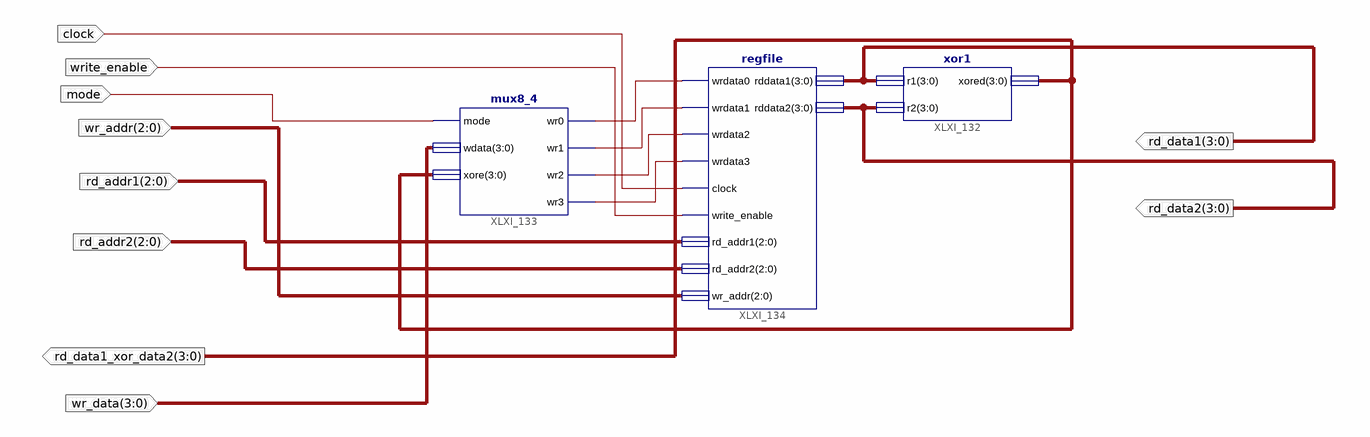
[diagram p0: schematic sheet 1]
// Xilinx ISE schematic lab3_reg_file.sch (artix7) as structural Verilog: 3 symbols, 10 ports
module lab3_reg_file (
  input  write_enable,
  input  mode,
  input  [2:0] wr_addr,
  input  [2:0] rd_addr1,
  input  [3:0] wr_data,
  input  [2:0] rd_addr2,
  input  clock,
  output [3:0] rd_data1_xor_data2,
  output [3:0] rd_data1,
  output [3:0] rd_data2
);

  wire XLXN_10, XLXN_11, XLXN_12, XLXN_13;

  xor1 XLXI_132 (.r1(rd_data1), .r2(rd_data2), .xored(rd_data1_xor_data2));
  mux8_4 XLXI_133 (
    .mode(mode), .wdata(wr_data), .wr0(XLXN_10), .wr1(XLXN_11), .wr2(XLXN_12), .wr3(XLXN_13),
    .xore(rd_data1_xor_data2));
  regfile XLXI_134 (
    .clock(clock), .rddata1(rd_data1), .rddata2(rd_data2), .rd_addr1(rd_addr1), .rd_addr2(rd_addr2),
    .wrdata0(XLXN_10), .wrdata1(XLXN_11), .wrdata2(XLXN_12), .wrdata3(XLXN_13), .write_enable(write_enable),
    .wr_addr(wr_addr));
endmodule
